# EAGLE design ARE_adaptadora_PIC_40pin (EAGLE 6.5.0)
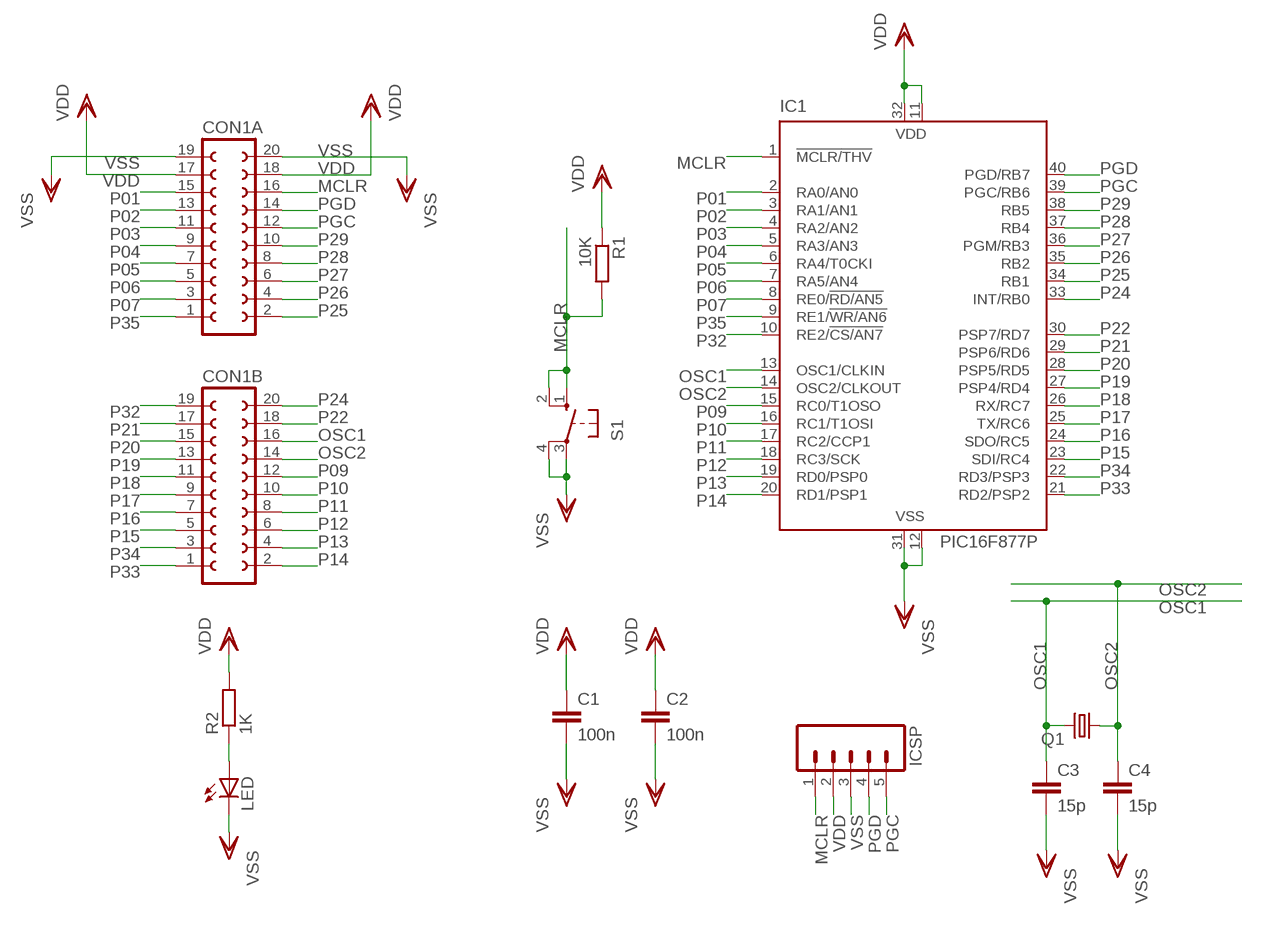
[diagram p0: schematic, sheet 1]

## Parts
C1  100n  C-EUC0805  [C0805]
C2  100n  C-EUC0805  [C0805]
C3  15p  C-EUC0805  [C0805]
C4  15p  C-EUC0805  [C0805]
CON1A  FE10-2W  [FE10-2W]
CON1B  FE10-2W  [FE10-2W]
IC1  PIC16F877P  [DIL40]
ICSP  M05PTH  [1X05]
LED  LED3MM  [LED3MM]
Q1  CRYSTALHC18U-V  [HC18U-V]
R1  10K  R-EU_R0805  [R0805]
R2  1K  R-EU_R0805  [R0805]
S1  10-XX  [B3F-10XX]

## Nets
MCLR: CON1A.16 IC1.1(!MCLR/THV) ICSP.1 R1.2 S1.1(S) S1.2(S1)
N$12: LED.A R2.1
OSC1: C3.1 CON1B.16 IC1.13(OSC1/CLKIN) Q1.2
OSC2: C4.1 CON1B.14 IC1.14(OSC2/CLKOUT) Q1.1
P01: CON1A.15 IC1.2(RA0/AN0)
P02: CON1A.13 IC1.3(RA1/AN1)
P03: CON1A.11 IC1.4(RA2/AN2)
P04: CON1A.9 IC1.5(RA3/AN3)
P05: CON1A.7 IC1.6(RA4/T0CKI)
P06: CON1A.5 IC1.7(RA5/AN4)
P07: CON1A.3 IC1.8(RE0/!RD/AN5)
P09: CON1B.12 IC1.15(RC0/T1OSO)
P10: CON1B.10 IC1.16(RC1/T1OSI)
P11: CON1B.8 IC1.17(RC2/CCP1)
P12: CON1B.6 IC1.18(RC3/SCK)
P13: CON1B.4 IC1.19(RD0/PSP0)
P14: CON1B.2 IC1.20(RD1/PSP1)
P15: CON1B.5 IC1.23(SDI/RC4)
P16: CON1B.7 IC1.24(SDO/RC5)
P17: CON1B.9 IC1.25(TX/RC6)
P18: CON1B.11 IC1.26(RX/RC7)
P19: CON1B.13 IC1.27(PSP4/RD4)
P20: CON1B.15 IC1.28(PSP5/RD5)
P21: CON1B.17 IC1.29(PSP6/RD6)
P22: CON1B.18 IC1.30(PSP7/RD7)
P24: CON1B.20 IC1.33(INT/RB0)
P25: CON1A.2 IC1.34(RB1)
P26: CON1A.4 IC1.35(RB2)
P27: CON1A.6 IC1.36(PGM/RB3)
P28: CON1A.8 IC1.37(RB4)
P29: CON1A.10 IC1.38(RB5)
P32: CON1B.19 IC1.10(RE2/!CS/AN7)
P33: CON1B.1 IC1.21(RD2/PSP2)
P34: CON1B.3 IC1.22(RD3/PSP3)
P35: CON1A.1 IC1.9(RE1/!WR/AN6)
PGC: CON1A.12 IC1.39(PGC/RB6) ICSP.5
PGD: CON1A.14 IC1.40(PGD/RB7) ICSP.4
VDD: C1.1 C2.1 CON1A.17 CON1A.18 IC1.11(VDD) IC1.32(VDD) ICSP.2 R1.1 R2.2
VSS: C1.2 C2.2 C3.2 C4.2 CON1A.19 CON1A.20 IC1.12(VSS) IC1.31(VSS) ICSP.3 LED.K(C) S1.3(P) S1.4(P1)

## Library data of the parts
C1-C4 = rcl:C-EU: CAPACITOR, European symbol
CON1A CON1B = con-lsta:FE10-2W: FEMALE HEADER; OC_FARNELL: unknown; OC_NEWARK: unknown
IC1 = microchip_nuevo:PIC16F87*: MICROCONTROLLER
ICSP = SparkFun:M05: Header 5 Standard 5-pin 0.1" header. Use with straight break away headers (SKU : PRT-00116), right angle break away headers (PRT-00553), swiss pins (PRT-00743), machine pins (PRT-00117), and female headers (PRT-00115). Molex polarized connector foot print use with SKU : PRT-08230 with associated crimp pins and housings.
LED = SparkFun:LED: LEDs Standard schematic elements and footprints for 5mm, 3mm, 1206, and 0603 sized LEDs. 5mm - Spark Fun Electronics SKU : COM-00529 (and others)
Q1 = crystal:CRYSTAL: CRYSTAL; OC_FARNELL: unknown; OC_NEWARK: unknown
R1 R2 = rcl:R-EU_: RESISTOR, European symbol
S1 = switch-omron:10-XX: OMRON SWITCH; MPN: B3F-1000; OC_FARNELL: 176432; OC_NEWARK: 36M3542

## Board
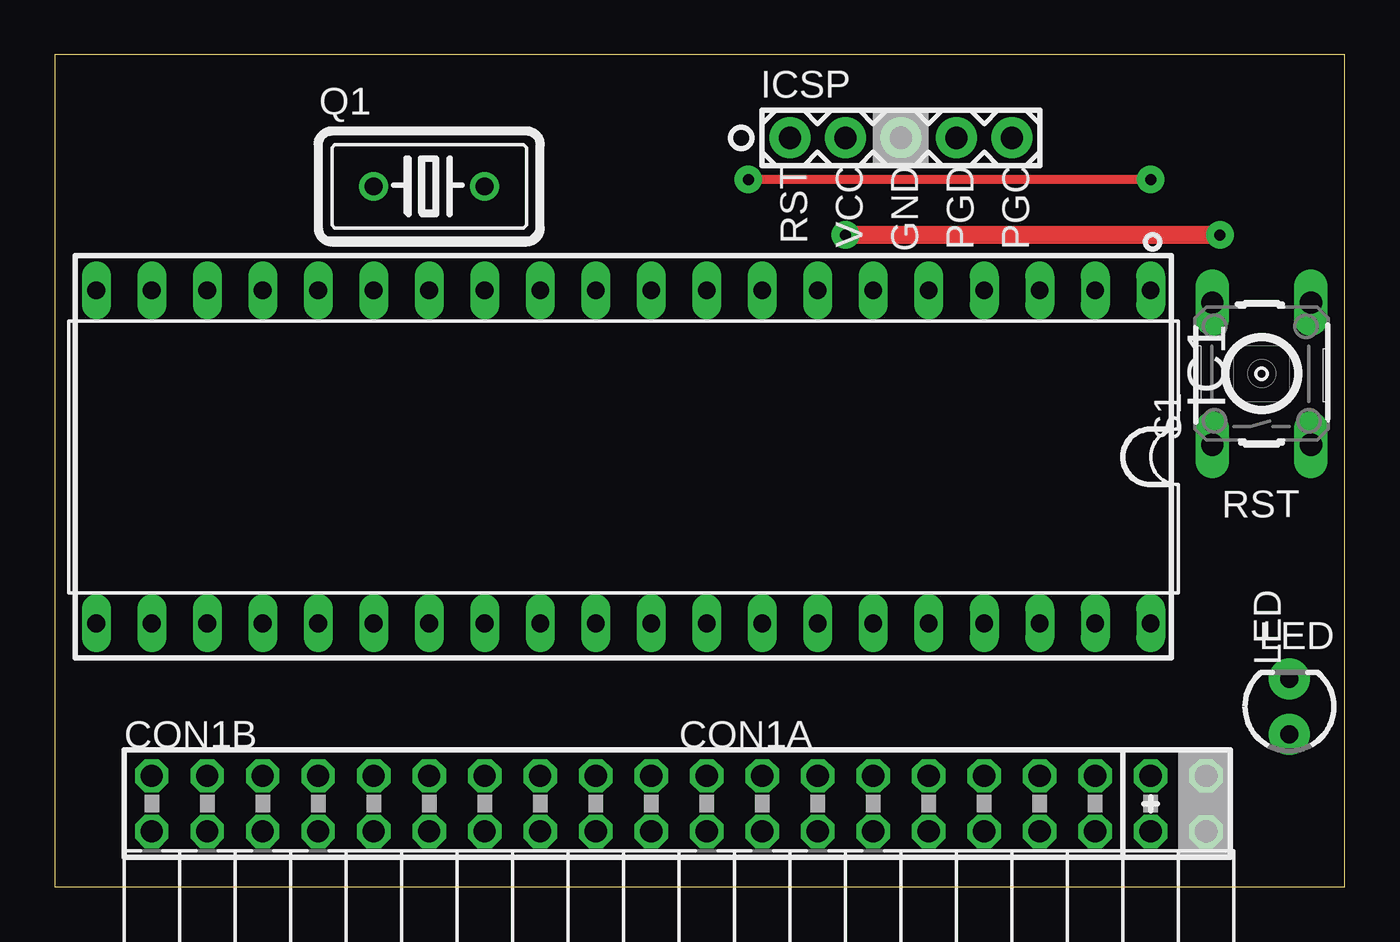
[diagram p1: board, top side]
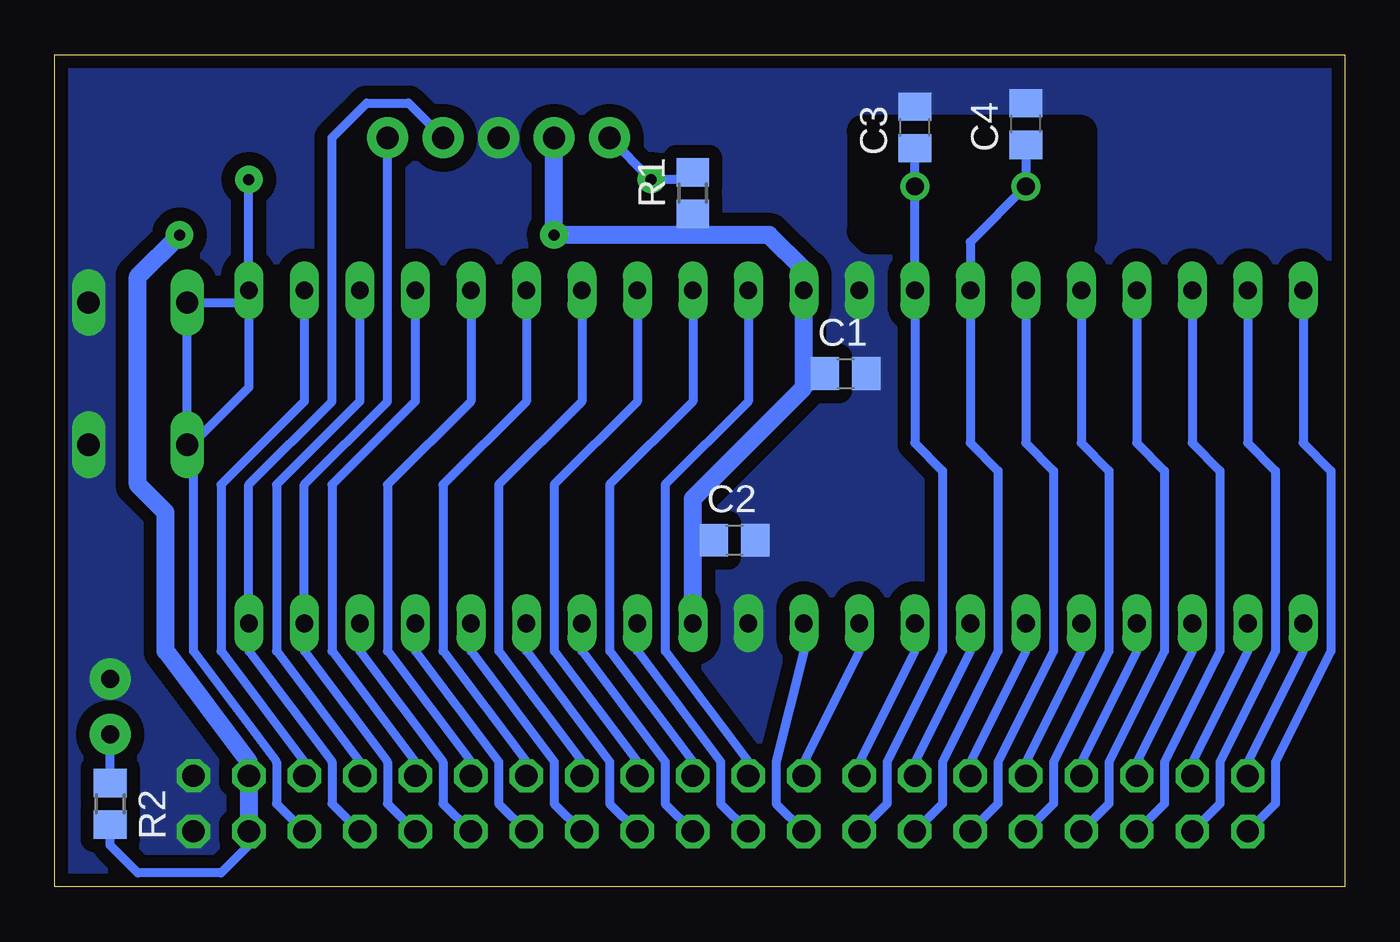
[diagram p2: board, bottom side, seen from below]

Size 59.05 x 38.1 mm. Coordinates in mm from the lower left corner, seen from the top.
Outline: 0,0 59.05,0 59.05,38.1 0,38.1 0,0
Copper layers (1*16): Top 0.035mm / dielectric 1.5mm / Bottom 0.035mm
Design rules "ITEADstudio_DRC": minimum track width 6mil, minimum drill 12mil, track to track 6mil, track to pad 6mil, pad to pad 6mil, via to via 6mil, smd to smd 0mil, copper to edge 10mil, drill to drill 10mil, minimum pad ring 10mil, minimum via ring 6mil, stop-mask expansion 2mil, vias tented up to drill 100mil, thermal gap 10mil
bRestrict: area 12.1,29.7 to 22.1,34.6

### Footprints (pad centres in the part's own frame; a part is rotated, then mirrored left to right if it is on the bottom)
C0805 = smd 1.3 x 1.5: 1 -0.95,0; 2 0.95,0
FE10-2W = drill 1.016 octagon: 1 -11.43,1.27; 2 -11.43,-1.27; 3 -8.89,1.27; 4 -8.89,-1.27; 5 -6.35,1.27; 6 -6.35,-1.27; 7 -3.81,1.27; 8 -3.81,-1.27; 9 -1.27,1.27; 10 -1.27,-1.27; 11 1.27,1.27; 12 1.27,-1.27; 13 3.81,1.27; 14 3.81,-1.27; 15 6.35,1.27; 16 6.35,-1.27; 17 8.89,1.27; 18 8.89,-1.27; 19 11.43,1.27; 20 11.43,-1.27
DIL40 = drill 0.813 long: 1 -24.13,-7.62; 2 -21.59,-7.62; 3 -19.05,-7.62; 4 -16.51,-7.62; 5 -13.97,-7.62; 6 -11.43,-7.62; 7 -8.89,-7.62; 8 -6.35,-7.62; 9 -3.81,-7.62; 10 -1.27,-7.62; 11 1.27,-7.62; 12 3.81,-7.62; 13 6.35,-7.62; 14 8.89,-7.62; 15 11.43,-7.62; 16 13.97,-7.62; 17 16.51,-7.62; 18 19.05,-7.62; 19 21.59,-7.62; 20 24.13,-7.62; 21 24.13,7.62; 22 21.59,7.62; 23 19.05,7.62; 24 16.51,7.62; 25 13.97,7.62; 26 11.43,7.62; 27 8.89,7.62; 28 6.35,7.62; 29 3.81,7.62; 30 1.27,7.62; 31 -1.27,7.62; 32 -3.81,7.62; 33 -6.35,7.62; 34 -8.89,7.62; 35 -11.43,7.62; 36 -13.97,7.62; 37 -16.51,7.62; 38 -19.05,7.62; 39 -21.59,7.62; 40 -24.13,7.62
1X05 = drill 1.016 pad 1.88: 1 0,0; 2 2.54,0; 3 5.08,0; 4 7.62,0; 5 10.16,0
LED3MM = drill 0.813 pad 1.88: A -1.27,0; K 1.27,0
HC18U-V = drill 0.813: 1 -2.54,0; 2 2.54,0
R0805 = smd 1.3 x 1.5: 1 -0.95,0; 2 0.95,0
B3F-10XX = drill 1.016 long: 1 -3.251,2.261; 2 3.251,2.261; 3 -3.251,-2.261; 4 3.251,-2.261

### Placement (x,y rotation side)
C1  22.86,23.5 0 bottom
C2  27.94,15.88 0 bottom
C3  19.69,34.77 90 bottom
C4  14.6,34.92 90 bottom
CON1A  41.27,3.81 0 top
CON1B  15.87,3.81 0 top
IC1  26.03,19.69 180 top
ICSP  33.66,34.29 0 top
LED  56.52,8.26 90 top
Q1  17.14,32.07 0 top
R1  29.84,31.75 90 bottom
R2  56.52,3.81 270 bottom
S1  55.25,23.5 90 top

### Tracks (layer width: path | path; a pad name or v marks a point on that pad's centre or on a via)
MCLR  (via drill 0.5 pad 1.27)
  Top 0.406: v50.17,32.39 v31.75,32.39
  Bottom 0.406: IC1.1 50.17,22.86 52.71,20.32 52.71,10.8 48.89,5.72 48.89,3.81 CON1A.16 | S1.1 S1.2 50.72,26.75 IC1.1 | IC1.1 v50.17,32.39 | ICSP.1 v31.75,32.39 30.17,32.39 R1.2
N$12
  Bottom 0.406: R2.1 LED.A
OSC1
  Bottom 0.406: CON1B.16 20.96,3.81 20.96,5.72 18.42,10.8 18.42,19.05 19.69,20.32 IC1.13 Q1.2 C3.1
OSC2
  Bottom 0.406: CON1B.14 18.42,3.81 18.42,5.72 15.87,10.8 15.87,19.05 17.14,20.32 IC1.14 17.14,29.53 Q1.1 C4.1
P01
  Bottom 0.406: IC1.2 47.63,22.23 51.43,18.42 51.43,10.8 47.63,5.72 CON1A.15
P02
  Bottom 0.406: IC1.3 45.09,22.23 48.89,18.42 48.89,10.8 45.09,5.72 CON1A.13
P03
  Bottom 0.406: IC1.4 42.54,22.23 46.35,18.42 46.35,10.8 42.54,5.72 CON1A.11
P04
  Bottom 0.406: IC1.5 40,22.23 43.81,18.42 43.81,10.8 40,5.72 CON1A.9
P05
  Bottom 0.406: IC1.6 37.46,22.23 41.28,18.42 41.28,10.8 37.46,5.72 CON1A.7
P06
  Bottom 0.406: IC1.7 34.92,22.23 38.74,18.42 38.74,10.8 34.92,5.72 CON1A.5
P07
  Bottom 0.406: IC1.8 32.39,22.23 36.2,18.42 36.2,10.8 32.39,5.72 CON1A.3
P09
  Bottom 0.406: IC1.15 14.6,20.32 13.33,19.05 13.33,10.8 15.87,5.72 15.87,3.81 CON1B.12
P10
  Bottom 0.406: IC1.16 12.06,20.32 10.8,19.05 10.8,10.8 13.33,5.72 13.33,3.81 CON1B.10
P11
  Bottom 0.406: IC1.17 9.53,20.32 8.26,19.05 8.26,10.8 10.8,5.72 10.8,3.81 CON1B.8
P12
  Bottom 0.406: IC1.18 6.99,20.32 5.71,19.05 5.71,10.8 8.26,5.72 8.26,3.81 CON1B.6
P13
  Bottom 0.406: IC1.19 4.44,20.32 3.17,19.05 3.17,10.8 5.71,5.72 5.71,3.81 CON1B.4
P14
  Bottom 0.406: IC1.20 1.9,20.32 0.64,19.05 0.64,10.8 3.17,5.72 3.17,3.81 CON1B.2
P15
  Bottom 0.406: IC1.23 6.99,10.8 9.53,5.72 CON1B.5
P16
  Bottom 0.406: IC1.24 9.53,10.8 12.06,5.72 CON1B.7
P17
  Bottom 0.406: IC1.25 12.06,10.8 14.6,5.72 CON1B.9
P18
  Bottom 0.406: IC1.26 14.6,10.8 17.14,5.72 CON1B.11
P19
  Bottom 0.406: IC1.27 17.14,10.8 19.69,5.72 CON1B.13
P20
  Bottom 0.406: IC1.28 19.69,10.8 22.22,5.72 CON1B.15
P21
  Bottom 0.406: IC1.29 22.22,10.8 24.77,5.72 CON1B.17
P22
  Bottom 0.406: IC1.30 24.77,10.8 26.03,5.72 26.03,3.81 CON1B.18
P24
  Bottom 0.406: IC1.33 32.39,10.8 28.57,5.72 28.57,3.81 CON1B.20
P25
  Bottom 0.406: IC1.34 34.92,10.8 31.11,5.72 31.11,3.81 CON1A.2
P26
  Bottom 0.406: IC1.35 37.46,10.8 33.66,5.72 33.66,3.81 CON1A.4
P27
  Bottom 0.406: IC1.36 40,10.8 36.2,5.72 36.2,3.81 CON1A.6
P28
  Bottom 0.406: IC1.37 42.54,10.8 38.74,5.72 38.74,3.81 CON1A.8
P29
  Bottom 0.406: IC1.38 45.09,10.8 41.28,5.72 41.28,3.81 CON1A.10
P32
  Bottom 0.406: IC1.10 27.31,22.23 31.11,18.42 31.11,10.8 27.31,5.72 CON1B.19
P33
  Bottom 0.406: IC1.21 1.9,10.8 4.44,5.72 CON1B.1
P34
  Bottom 0.406: IC1.22 4.44,10.8 6.99,5.72 CON1B.3
P35
  Bottom 0.406: IC1.9 29.85,22.23 33.66,18.42 33.66,10.8 29.85,5.72 CON1A.1
PGC
  Bottom 0.406: CON1A.12 43.81,3.81 43.81,5.72 47.63,10.8 IC1.39 47.63,18.42 43.81,22.23 ICSP.5
PGD
  Bottom 0.406: CON1A.14 46.35,3.81 46.35,5.72 50.17,10.8 IC1.40 50.17,18.42 46.35,22.23 46.35,34.29 44.77,35.88 42.86,35.88 ICSP.4
VDD  (via drill 0.5 pad 1.27)
  Top 0.813: v53.34,29.85 v36.2,29.85
  Bottom 0.406: C1.1 24.77,23.5 | C2.1 29.85,15.88 | CON1A.18 50.17,1.91 51.43,0.64 55.25,0.64 56.52,1.91 R2.2 | R1.1 29.85,29.85
  Bottom 0.813: IC1.32 29.85,15.88 29.85,17.78 24.77,22.86 24.77,23.5 IC1.11 24.77,28.26 26.35,29.85 29.85,29.85 v36.2,29.85 ICSP.2 | v53.34,29.85 55.25,27.94 55.25,18.42 53.97,17.15 53.97,10.8 50.17,5.72 CON1A.17 CON1A.18
VSS
  pour Bottom (isolate 0.61, no thermals): 0,0 59.05,0 59.05,38.1 0,38.1

### Text on the board
_tsilk: RST | VCC | GND | PGD | PGC | RST | LED